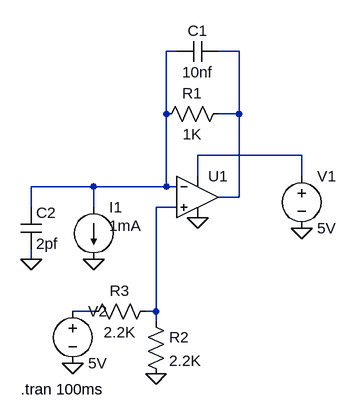
[diagram p0: schematic Transimpedance Amplifier Test.asc]
Transimpedance Amplifier Test.asc, the LTspice schematic file:
Version 4
SHEET 1 880 680
WIRE 192 -96 176 -96
WIRE 288 -96 256 -96
WIRE 176 0 176 -96
WIRE 288 0 288 -96
WIRE 288 0 256 0
WIRE 384 64 224 64
WIRE 224 96 224 64
WIRE 384 96 384 64
WIRE 64 112 -32 112
WIRE 176 112 176 0
WIRE 176 112 64 112
WIRE 192 112 176 112
WIRE 288 128 288 0
WIRE 288 128 256 128
WIRE -32 144 -32 112
WIRE 64 144 64 112
WIRE 192 144 160 144
WIRE -32 224 -32 208
WIRE 64 304 32 304
WIRE 160 304 160 144
WIRE 160 304 144 304
WIRE 160 320 160 304
FLAG 64 224 0
FLAG 224 160 0
FLAG 384 176 0
FLAG 160 400 0
FLAG 32 384 0
FLAG -32 224 0
SYMBOL OpAmps\\UniversalOpAmp 224 128 R0
SYMATTR InstName U1
SYMBOL res 272 -16 R90
WINDOW 0 0 56 VBottom 2
WINDOW 3 32 56 VTop 2
SYMATTR InstName R1
SYMATTR Value 1K
SYMBOL cap 256 -112 R90
WINDOW 0 0 32 VBottom 2
WINDOW 3 32 32 VTop 2
SYMATTR InstName C1
SYMATTR Value 10nf
SYMBOL current 64 144 R0
WINDOW 3 24 28 Left 2
WINDOW 123 0 0 Left 0
WINDOW 39 0 0 Left 0
SYMATTR InstName I1
SYMATTR Value 1mA
SYMBOL voltage 384 80 R0
WINDOW 123 0 0 Left 0
WINDOW 39 0 0 Left 0
SYMATTR InstName V1
SYMATTR Value 5V
SYMBOL res 144 304 R0
SYMATTR InstName R2
SYMATTR Value 2.2K
SYMBOL res 160 288 R90
WINDOW 0 0 56 VBottom 2
WINDOW 3 32 56 VTop 2
SYMATTR InstName R3
SYMATTR Value 2.2K
SYMBOL voltage 32 288 R0
WINDOW 123 0 0 Left 0
WINDOW 39 0 0 Left 0
SYMATTR InstName V2
SYMATTR Value 5V
SYMBOL cap -48 144 R0
SYMATTR InstName C2
SYMATTR Value 2pf
TEXT -48 424 Left 2 !.tran 100ms

The netlist it stands for:
* Transimpedance Amplifier Test.asc
XU1 N004 N001 N003 0 N002 level1 Avol=1Meg GBW=10Meg Vos=0 En=0 Enk=0 In=0 Ink=0 Rin=500Meg  ; pins In+ In- V+ V- OUT
R1 N002 N001 1K
C1 N002 N001 10nf
I1 N001 0 1mA
V1 N003 0 5V
R2 N004 0 2.2K
R3 N004 N005 2.2K
V2 N005 0 5V
C2 N001 0 2pf
.tran 100ms
.lib UniversalOpAmp1.lib
.backanno
.end